# Altium schematic sheet NB3000_Audio_Service.SchDoc
size A
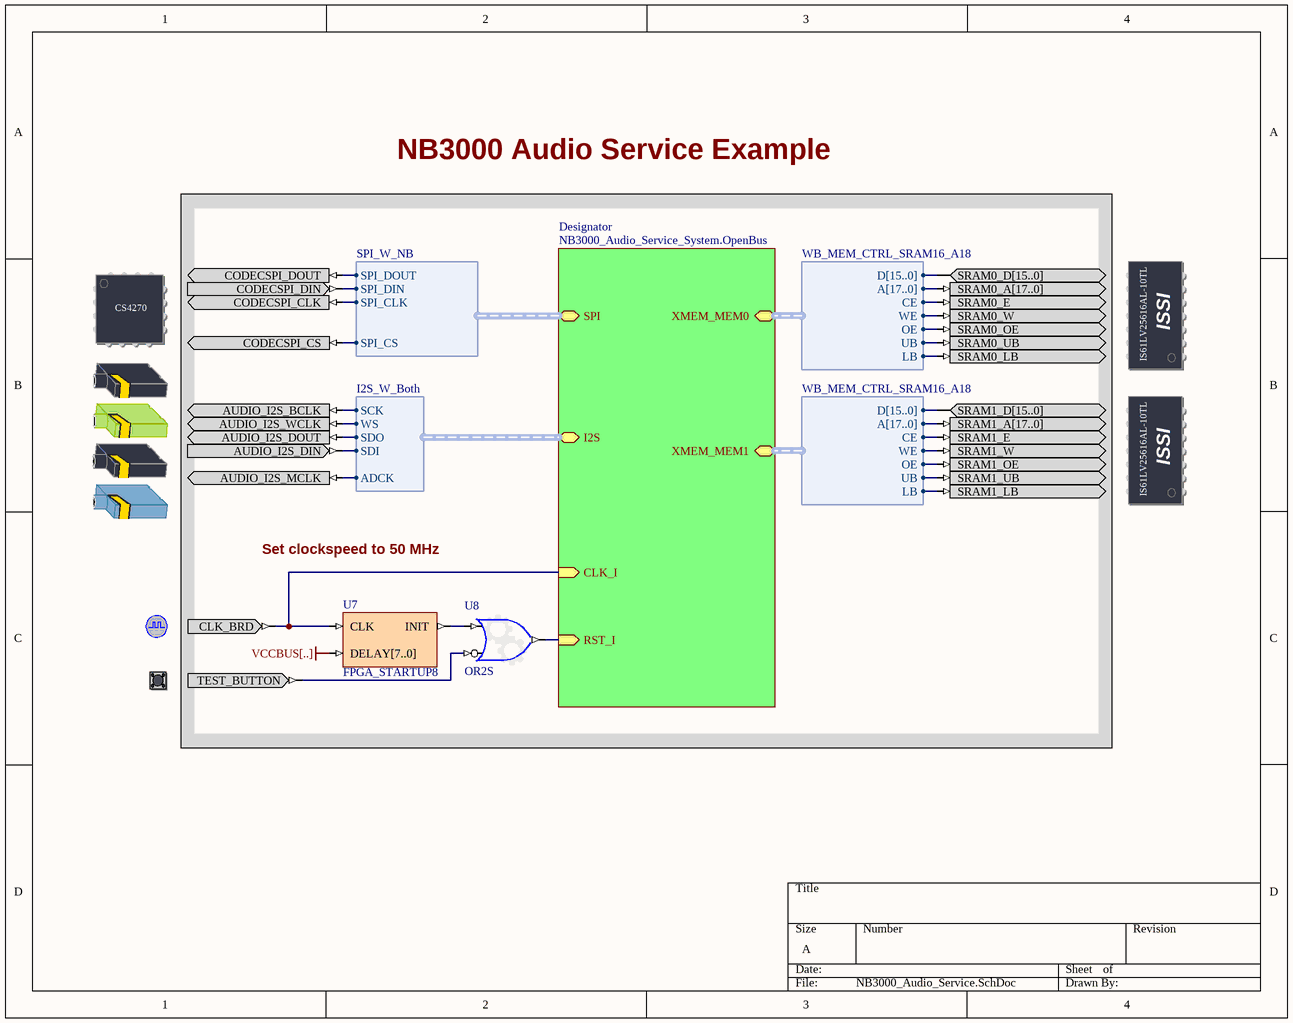
[diagram p0: NB3000_Audio_Service.SchDoc]

## Parts
(Parts that share a designator on the sheet are numbered #1, #2 ... from top to bottom, then left to right.)
?#1  AUDIO_CODEC_CTRL  (value not drawn)
?#2  SRAM0  (value not drawn)
?#3  AUDIO_CODEC  (value not drawn)
?#4  SRAM1  (value not drawn)
?#5  CLOCK_BOARD  (value not drawn)
?#6  TEST_BUTTON  (value not drawn)
U7  FPGA_STARTUP8
U8  OR2S

## Blocks framed on the sheet
Set clockspeed to 50 MHz: ?#1-?#6 U7 U8

## Sub-sheets
Designator = NB3000_Audio_Service_System.OpenBus: XMEM_MEM0 (harness WB_MEM_CTRL_SRAM16_A18), XMEM_MEM1 (harness WB_MEM_CTRL_SRAM16_A18), RST_I (in), CLK_I (in), I2S (harness I2S_W_Both), SPI (harness SPI_W_NB)

## Harnesses
I2S_W_Both: SCK, WS, SDO, SDI, ADCK
SPI_W_NB: SPI_DOUT, SPI_DIN, SPI_CLK, SPI_CS
WB_MEM_CTRL_SRAM16_A18: D[15..0], A[17..0], CE, WE, OE, UB, LB

## Nets
VCCBUS[..]: U7.DELAY[7..0]
Net?#1_CODECSPI_CLK: ?#1.CODECSPI_CLK ; sheet Designator/SPI.SPI_CLK
Net?#1_CODECSPI_CS: ?#1.CODECSPI_CS ; sheet Designator/SPI.SPI_CS
Net?#1_CODECSPI_DIN: ?#1.CODECSPI_DIN ; sheet Designator/SPI.SPI_DIN
Net?#1_CODECSPI_DOUT: ?#1.CODECSPI_DOUT ; sheet Designator/SPI.SPI_DOUT
Net?#2_SRAM0_A[17..0]: ?#2.SRAM0_A[17..0] ; sheet Designator/XMEM_MEM0.A[17..0]
Net?#2_SRAM0_D[15..0]: ?#2.SRAM0_D[15..0] ; sheet Designator/XMEM_MEM0.D[15..0]
Net?#2_SRAM0_E: ?#2.SRAM0_E ; sheet Designator/XMEM_MEM0.CE
Net?#2_SRAM0_LB: ?#2.SRAM0_LB ; sheet Designator/XMEM_MEM0.LB
Net?#2_SRAM0_OE: ?#2.SRAM0_OE ; sheet Designator/XMEM_MEM0.OE
Net?#2_SRAM0_UB: ?#2.SRAM0_UB ; sheet Designator/XMEM_MEM0.UB
Net?#2_SRAM0_W: ?#2.SRAM0_W ; sheet Designator/XMEM_MEM0.WE
Net?#3_AUDIO_I2S_BCLK: ?#3.AUDIO_I2S_BCLK ; sheet Designator/I2S.SCK
Net?#3_AUDIO_I2S_DIN: ?#3.AUDIO_I2S_DIN ; sheet Designator/I2S.SDI
Net?#3_AUDIO_I2S_DOUT: ?#3.AUDIO_I2S_DOUT ; sheet Designator/I2S.SDO
Net?#3_AUDIO_I2S_MCLK: ?#3.AUDIO_I2S_MCLK ; sheet Designator/I2S.ADCK
Net?#3_AUDIO_I2S_WCLK: ?#3.AUDIO_I2S_WCLK ; sheet Designator/I2S.WS
Net?#4_SRAM1_A[17..0]: ?#4.SRAM1_A[17..0] ; sheet Designator/XMEM_MEM1.A[17..0]
Net?#4_SRAM1_D[15..0]: ?#4.SRAM1_D[15..0] ; sheet Designator/XMEM_MEM1.D[15..0]
Net?#4_SRAM1_E: ?#4.SRAM1_E ; sheet Designator/XMEM_MEM1.CE
Net?#4_SRAM1_LB: ?#4.SRAM1_LB ; sheet Designator/XMEM_MEM1.LB
Net?#4_SRAM1_OE: ?#4.SRAM1_OE ; sheet Designator/XMEM_MEM1.OE
Net?#4_SRAM1_UB: ?#4.SRAM1_UB ; sheet Designator/XMEM_MEM1.UB
Net?#4_SRAM1_W: ?#4.SRAM1_W ; sheet Designator/XMEM_MEM1.WE
Net?#5_CLK_BRD: ?#5.CLK_BRD U7.CLK ; sheet Designator/CLK_I
Net?#6_TEST_BUTTON: ?#6.TEST_BUTTON U8.I1
NetU7_INIT: U7.INIT U8.I0
NetU8_O: U8.O ; sheet Designator/RST_I

## Notes on the sheet
- NB3000 Audio Service Example
- (in symbol AUDIO_CODEC_CTRL) CS4270
- (in symbol SRAM0) ISSI; IS61LV25616AL-10TL
- (in symbol SRAM1) ISSI; IS61LV25616AL-10TL

## Library data of the parts
?#1 = AUDIO_CODEC_CTRL: Audio Codec Control; PortComponent: True; Published: 22-Jan-2007; Publisher: Altium Limited; HelpURL: https://wiki.altium.com/display/ADOH/NanoBoard+3000+-+Audio+CODEC
?#2 = SRAM0: Free Static RAM - Daughterboard; PortComponent: True; Published: 14-May-2007; Publisher: Altium Limited; HelpURL: https://wiki.altium.com/display/ADOH/NanoBoard+3000+-+Independent+SRAM
?#3 = AUDIO_CODEC: Audio Codec; PortComponent: True; IncludeInDSF: AUDIO_CS4270; Published: 22-Jan-2007; Publisher: Altium Limited; HelpURL: https://wiki.altium.com/display/ADOH/NanoBoard+3000+-+Audio+CODEC
?#4 = SRAM1: Free Static RAM - Daughterboard; PortComponent: True; Published: 14-May-2007; Publisher: Altium Limited; HelpURL: https://wiki.altium.com/display/ADOH/NanoBoard+3000+-+Independent+SRAM
?#5 = CLOCK_BOARD: Global System Clock Supply; PortComponent: True; Published: 19-Nov-2003; Publisher: Altium Limited; HelpURL: TR0143 Technical Reference Manual for Altium's Desktop NanoBoard NB2DSK01.pdf#page=41; UseInDSF: True
?#6 = TEST_BUTTON: Test / Reset Button; PortComponent: True; Published: 19-Nov-2003; Publisher: Altium Limited; HelpURL: TR0143 Technical Reference Manual for Altium's Desktop NanoBoard NB2DSK01.pdf#page=53
U7 = FPGA_STARTUP8: FPGA Startup With 8 Bit Delay; Published: 9-Dec-2004; Publisher: Altium Limited; HelpURL: CR0119 FPGA_STARTUPx Powerup Delay Unit.pdf; LastRevisionNo: 1.00.00; ComponentLink1Description: Core &Resource Usage; ComponentLink1URL: CR0139 FPGA Peripheral Resource Usage.pdf#page=11
U8 = GATE: Configurable Generic Gate; ConfiguratorName: GENERIC_GATE; ConfigurationParameters: {}Version[1.0]{}GateKind[OR]{}BusInput[False]{}GateInputType[Bit]{}GateOutputOption[Normal]{}BusWidth[8]{}RegisterOutputs[False]{}NegativeClockEdge[False]{}InputCount[2]{}InputInvert0[False]{}InputInvert1[True]{}; LastRevisionNo: 1.00.00; Published: 3-Sep-2008; Publisher: Altium Limited